# Altium schematic sheet SFPGA.SchDoc: System FPGA
size 420 x 297 mm; CheckedBy: T.Janicki; CompanyName: Creotech Instruments SA; DrawnBy: G.Kasprowicz; Organization: CERN; Address1: European Organization for Nuclear Research; Address2: CH-1211 Geneve 23 - Switzerland; DocumentNumber: 10; Revision: -; SheetNumber: 15; SheetTotal: 21; EDA_Number: EDA-xxxx; Projet: Simple VME FMC Carrier; CreateDate: 20/11/2012; CheckedDate: 30/04/2012; DivGrp: BE-CO; Designer: G.Kasprowicz; DocumentName: SFPGA.SchDoc; ModifiedDate: -; Rule: PcbType=ProtelPcb
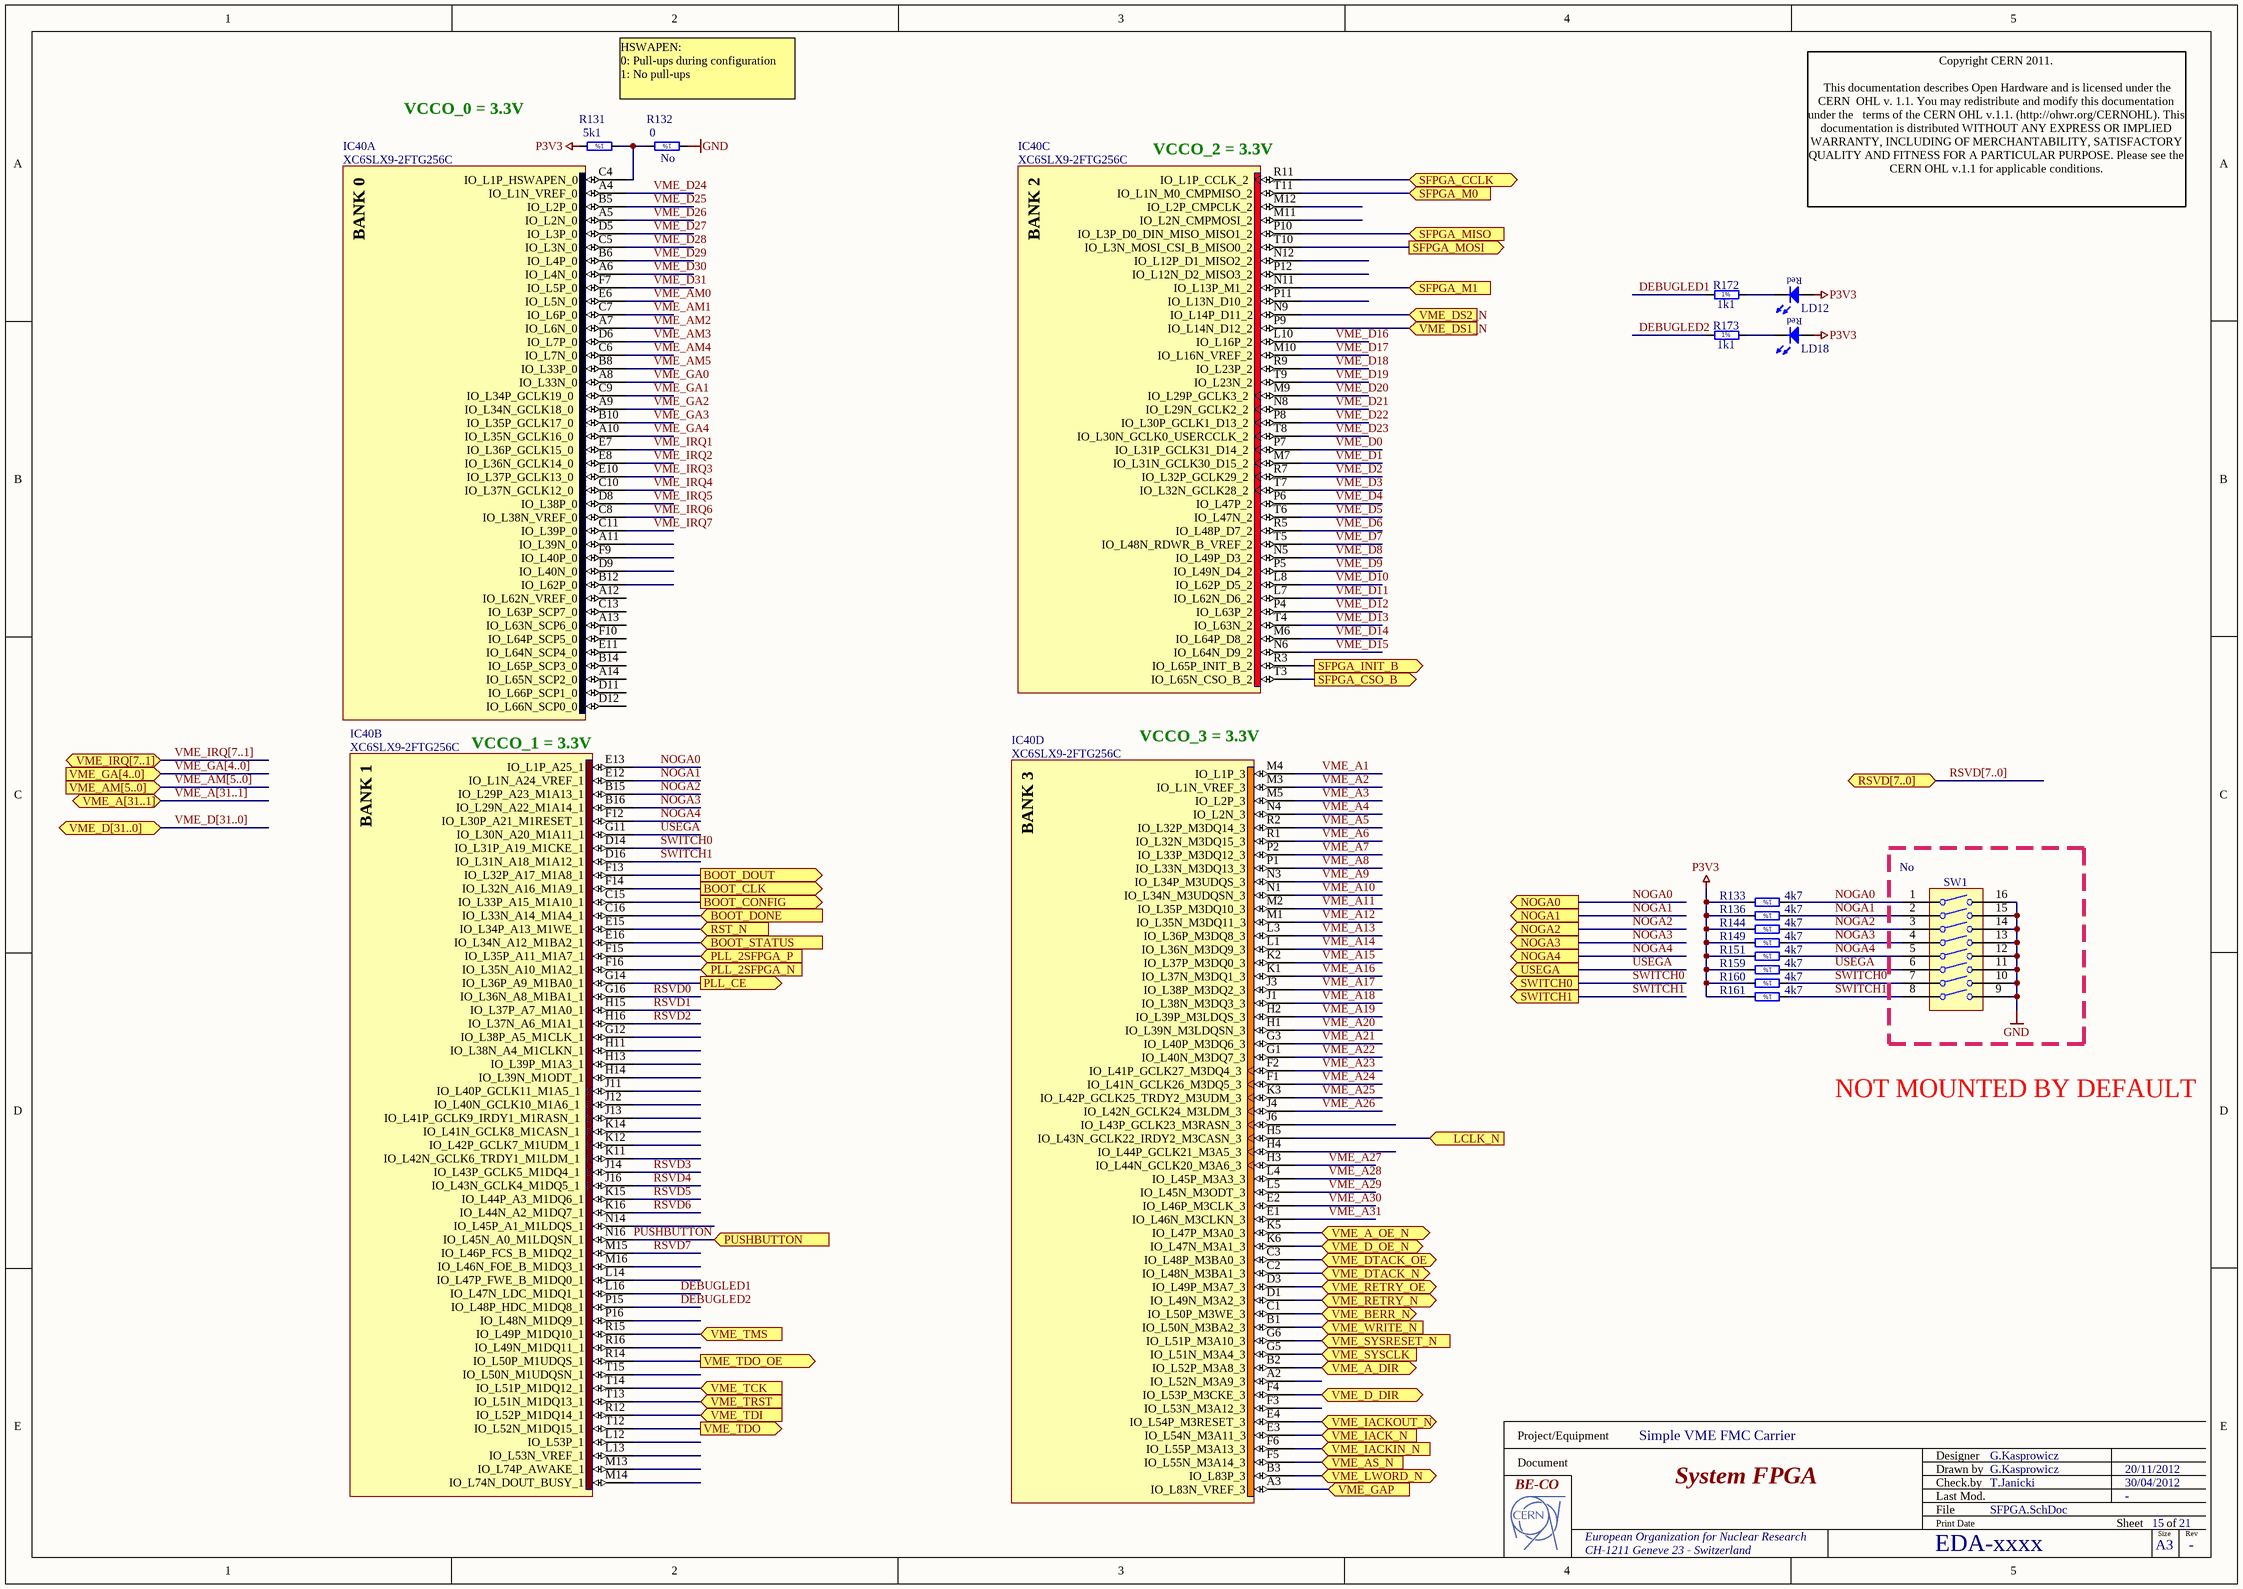
[diagram p0: SFPGA.SchDoc]

## Parts
IC40  XC6SLX9-2FTG256C  [BGA256C100P16X16_1700X1700X155]  (parts A,B,C,D of 7)
LD12  Red  [LEDC1608X80N_RED]  (value not drawn)
LD18  Red  [LEDC1608X80N_RED]  (value not drawn)
R131  5k1  [RESC1608X55N]
R132  0  Mounted: No  [RESC1608X55N]
R133  4k7  [RESC1608X55N]
R136  4k7  [RESC1608X55N]
R144  4k7  [RESC1608X55N]
R149  4k7  [RESC1608X55N]
R151  4k7  [RESC1608X55N]
R159  4k7  [RESC1608X55N]
R160  4k7  [RESC1608X55N]
R161  4k7  [RESC1608X55N]
R172  1k1  [RESC1608X55N]
R173  1k1  [RESC1608X55N]
SW1  Mounted: No  [SW_TYCO_1-1571983-0]  (hidden comment: Switch)

## Ports
BOOT_CLK (out), BOOT_CONFIG (out), BOOT_DONE (in), BOOT_DOUT (out), BOOT_STATUS (in), LCLK_N (in), NOGA0 (out), NOGA1 (out), NOGA2 (out), NOGA3 (out), NOGA4 (out), PLL_2SFPGA_N (in), PLL_2SFPGA_P (in), PLL_CE (out), PUSHBUTTON (in), RST_N (in), RSVD[7..0] (bidir), SFPGA_CCLK (bidir), SFPGA_CSO_B (out), SFPGA_INIT_B (out), SFPGA_M0 (in), SFPGA_M1 (in), SFPGA_MISO (in), SFPGA_MOSI (out), SWITCH0 (out), SWITCH1 (out), USEGA (out), VME_A[31..1] (bidir), VME_A_DIR (bidir), VME_A_OE_N (bidir), VME_AM[5..0] (in), VME_AS_N (in), VME_BERR_N (bidir), VME_D[31..0] (bidir), VME_D_DIR (bidir), VME_D_OE_N (bidir), VME_DS1_N (in), VME_DS2_N (in), VME_DTACK_N (bidir), VME_DTACK_OE (bidir), VME_GA[4..0] (in), VME_GAP (in), VME_IACK_N (in), VME_IACKIN_N (in), VME_IACKOUT_N (bidir), VME_IRQ[7..1] (bidir), VME_LWORD_N (bidir), VME_RETRY_N (bidir), VME_RETRY_OE (bidir), VME_SYSCLK (in), VME_SYSRESET_N (in), VME_TCK (in), VME_TDI (in), VME_TDO (out), VME_TDO_OE (out), VME_TMS (in), VME_TRST (in), VME_WRITE_N (in)

## Nets
GND: R132.1 SW1.9 SW1.10 SW1.11 SW1.12 SW1.13 SW1.14 SW1.15 SW1.16
P3V3: LD12.2(A) LD18.2(A) R131.2 R133.2 R136.2 R144.2 R149.2 R151.2 R159.2 R160.2 R161.2
BOOT_CLK: IC40.F14(IO_L32N_A16_M1A9_1) ; port BOOT_CLK
BOOT_CONFIG: IC40.C15(IO_L33P_A15_M1A10_1) ; port BOOT_CONFIG
BOOT_DONE: IC40.C16(IO_L33N_A14_M1A4_1) ; port BOOT_DONE
BOOT_DOUT: IC40.F13(IO_L32P_A17_M1A8_1) ; port BOOT_DOUT
BOOT_STATUS: IC40.E16(IO_L34N_A12_M1BA2_1) ; port BOOT_STATUS
DEBUGLED1: IC40.L16(IO_L47N_LDC_M1DQ1_1) R172.1
DEBUGLED2: IC40.P15(IO_L48P_HDC_M1DQ8_1) R173.1
LCLK_N: IC40.H5(IO_L43N_GCLK22_IRDY2_M3CASN_3) ; port LCLK_N
NOGA0: IC40.E13(IO_L1P_A25_1) R133.1 SW1.1 ; port NOGA0
NOGA1: IC40.E12(IO_L1N_A24_VREF_1) R136.1 SW1.2 ; port NOGA1
NOGA2: IC40.B15(IO_L29P_A23_M1A13_1) R144.1 SW1.3 ; port NOGA2
NOGA3: IC40.B16(IO_L29N_A22_M1A14_1) R149.1 SW1.4 ; port NOGA3
NOGA4: IC40.F12(IO_L30P_A21_M1RESET_1) R151.1 SW1.5 ; port NOGA4
PLL_2SFPGA_N: IC40.F16(IO_L35N_A10_M1A2_1) ; port PLL_2SFPGA_N
PLL_2SFPGA_P: IC40.F15(IO_L35P_A11_M1A7_1) ; port PLL_2SFPGA_P
PLL_CE: IC40.G14(IO_L36P_A9_M1BA0_1) ; port PLL_CE
PUSHBUTTON: IC40.N16(IO_L45N_A0_M1LDQSN_1) ; port PUSHBUTTON
RST_N: IC40.E15(IO_L34P_A13_M1WE_1) ; port RST_N
RSVD0: IC40.G16(IO_L36N_A8_M1BA1_1)
RSVD1: IC40.H15(IO_L37P_A7_M1A0_1)
RSVD2: IC40.H16(IO_L37N_A6_M1A1_1)
RSVD3: IC40.J14(IO_L43P_GCLK5_M1DQ4_1)
RSVD4: IC40.J16(IO_L43N_GCLK4_M1DQ5_1)
RSVD5: IC40.K15(IO_L44P_A3_M1DQ6_1)
RSVD6: IC40.K16(IO_L44N_A2_M1DQ7_1)
RSVD7: IC40.M15(IO_L46P_FCS_B_M1DQ2_1)
SFPGA_CCLK: IC40.R11(IO_L1P_CCLK_2) ; port SFPGA_CCLK
SFPGA_CSO_B: IC40.T3(IO_L65N_CSO_B_2) ; port SFPGA_CSO_B
SFPGA_INIT_B: IC40.R3(IO_L65P_INIT_B_2) ; port SFPGA_INIT_B
SFPGA_M0: IC40.T11(IO_L1N_M0_CMPMISO_2) ; port SFPGA_M0
SFPGA_M1: IC40.N11(IO_L13P_M1_2) ; port SFPGA_M1
SFPGA_MISO: IC40.P10(IO_L3P_D0_DIN_MISO_MISO1_2) ; port SFPGA_MISO
SFPGA_MOSI: IC40.T10(IO_L3N_MOSI_CSI_B_MISO0_2) ; port SFPGA_MOSI
SWITCH0: IC40.D14(IO_L31P_A19_M1CKE_1) R160.1 SW1.7 ; port SWITCH0
SWITCH1: IC40.D16(IO_L31N_A18_M1A12_1) R161.1 SW1.8 ; port SWITCH1
USEGA: IC40.G11(IO_L30N_A20_M1A11_1) R159.1 SW1.6 ; port USEGA
VME_A1: IC40.M4(IO_L1P_3)
VME_A2: IC40.M3(IO_L1N_VREF_3)
VME_A3: IC40.M5(IO_L2P_3)
VME_A4: IC40.N4(IO_L2N_3)
VME_A5: IC40.R2(IO_L32P_M3DQ14_3)
VME_A6: IC40.R1(IO_L32N_M3DQ15_3)
VME_A7: IC40.P2(IO_L33P_M3DQ12_3)
VME_A8: IC40.P1(IO_L33N_M3DQ13_3)
VME_A9: IC40.N3(IO_L34P_M3UDQS_3)
VME_A10: IC40.N1(IO_L34N_M3UDQSN_3)
VME_A11: IC40.M2(IO_L35P_M3DQ10_3)
VME_A12: IC40.M1(IO_L35N_M3DQ11_3)
VME_A13: IC40.L3(IO_L36P_M3DQ8_3)
VME_A14: IC40.L1(IO_L36N_M3DQ9_3)
VME_A15: IC40.K2(IO_L37P_M3DQ0_3)
VME_A16: IC40.K1(IO_L37N_M3DQ1_3)
VME_A17: IC40.J3(IO_L38P_M3DQ2_3)
VME_A18: IC40.J1(IO_L38N_M3DQ3_3)
VME_A19: IC40.H2(IO_L39P_M3LDQS_3)
VME_A20: IC40.H1(IO_L39N_M3LDQSN_3)
VME_A21: IC40.G3(IO_L40P_M3DQ6_3)
VME_A22: IC40.G1(IO_L40N_M3DQ7_3)
VME_A23: IC40.F2(IO_L41P_GCLK27_M3DQ4_3)
VME_A24: IC40.F1(IO_L41N_GCLK26_M3DQ5_3)
VME_A25: IC40.K3(IO_L42P_GCLK25_TRDY2_M3UDM_3)
VME_A26: IC40.J4(IO_L42N_GCLK24_M3LDM_3)
VME_A27: IC40.H3(IO_L44N_GCLK20_M3A6_3)
VME_A28: IC40.L4(IO_L45P_M3A3_3)
VME_A29: IC40.L5(IO_L45N_M3ODT_3)
VME_A30: IC40.E2(IO_L46P_M3CLK_3)
VME_A31: IC40.E1(IO_L46N_M3CLKN_3)
VME_A_DIR: IC40.B2(IO_L52P_M3A8_3) ; port VME_A_DIR
VME_A_OE_N: IC40.K5(IO_L47P_M3A0_3) ; port VME_A_OE_N
VME_AM0: IC40.E6(IO_L5N_0)
VME_AM1: IC40.C7(IO_L6P_0)
VME_AM2: IC40.A7(IO_L6N_0)
VME_AM3: IC40.D6(IO_L7P_0)
VME_AM4: IC40.C6(IO_L7N_0)
VME_AM5: IC40.B8(IO_L33P_0)
VME_AS_N: IC40.F5(IO_L55N_M3A14_3) ; port VME_AS_N
VME_BERR_N: IC40.C1(IO_L50P_M3WE_3) ; port VME_BERR_N
VME_D0: IC40.P7(IO_L31P_GCLK31_D14_2)
VME_D1: IC40.M7(IO_L31N_GCLK30_D15_2)
VME_D2: IC40.R7(IO_L32P_GCLK29_2)
VME_D3: IC40.T7(IO_L32N_GCLK28_2)
VME_D4: IC40.P6(IO_L47P_2)
VME_D5: IC40.T6(IO_L47N_2)
VME_D6: IC40.R5(IO_L48P_D7_2)
VME_D7: IC40.T5(IO_L48N_RDWR_B_VREF_2)
VME_D8: IC40.N5(IO_L49P_D3_2)
VME_D9: IC40.P5(IO_L49N_D4_2)
VME_D10: IC40.L8(IO_L62P_D5_2)
VME_D11: IC40.L7(IO_L62N_D6_2)
VME_D12: IC40.P4(IO_L63P_2)
VME_D13: IC40.T4(IO_L63N_2)
VME_D14: IC40.M6(IO_L64P_D8_2)
VME_D15: IC40.N6(IO_L64N_D9_2)
VME_D16: IC40.L10(IO_L16P_2)
VME_D17: IC40.M10(IO_L16N_VREF_2)
VME_D18: IC40.R9(IO_L23P_2)
VME_D19: IC40.T9(IO_L23N_2)
VME_D20: IC40.M9(IO_L29P_GCLK3_2)
VME_D21: IC40.N8(IO_L29N_GCLK2_2)
VME_D22: IC40.P8(IO_L30P_GCLK1_D13_2)
VME_D23: IC40.T8(IO_L30N_GCLK0_USERCCLK_2)
VME_D24: IC40.A4(IO_L1N_VREF_0)
VME_D25: IC40.B5(IO_L2P_0)
VME_D26: IC40.A5(IO_L2N_0)
VME_D27: IC40.D5(IO_L3P_0)
VME_D28: IC40.C5(IO_L3N_0)
VME_D29: IC40.B6(IO_L4P_0)
VME_D30: IC40.A6(IO_L4N_0)
VME_D31: IC40.F7(IO_L5P_0)
VME_D_DIR: IC40.F4(IO_L53P_M3CKE_3) ; port VME_D_DIR
VME_D_OE_N: IC40.K6(IO_L47N_M3A1_3) ; port VME_D_OE_N
VME_DS1_N: IC40.P9(IO_L14N_D12_2) ; port VME_DS1_N
VME_DS2_N: IC40.N9(IO_L14P_D11_2) ; port VME_DS2_N
VME_DTACK_N: IC40.C2(IO_L48N_M3BA1_3) ; port VME_DTACK_N
VME_DTACK_OE: IC40.C3(IO_L48P_M3BA0_3) ; port VME_DTACK_OE
VME_GA0: IC40.A8(IO_L33N_0)
VME_GA1: IC40.C9(IO_L34P_GCLK19_0)
VME_GA2: IC40.A9(IO_L34N_GCLK18_0)
VME_GA3: IC40.B10(IO_L35P_GCLK17_0)
VME_GA4: IC40.A10(IO_L35N_GCLK16_0)
VME_GAP: IC40.A3(IO_L83N_VREF_3) ; port VME_GAP
VME_IACK_N: IC40.E3(IO_L54N_M3A11_3) ; port VME_IACK_N
VME_IACKIN_N: IC40.F6(IO_L55P_M3A13_3) ; port VME_IACKIN_N
VME_IACKOUT_N: IC40.E4(IO_L54P_M3RESET_3) ; port VME_IACKOUT_N
VME_IRQ1: IC40.E7(IO_L36P_GCLK15_0)
VME_IRQ2: IC40.E8(IO_L36N_GCLK14_0)
VME_IRQ3: IC40.E10(IO_L37P_GCLK13_0)
VME_IRQ4: IC40.C10(IO_L37N_GCLK12_0)
VME_IRQ5: IC40.D8(IO_L38P_0)
VME_IRQ6: IC40.C8(IO_L38N_VREF_0)
VME_IRQ7: IC40.C11(IO_L39P_0)
VME_LWORD_N: IC40.B3(IO_L83P_3) ; port VME_LWORD_N
VME_RETRY_N: IC40.D1(IO_L49N_M3A2_3) ; port VME_RETRY_N
VME_RETRY_OE: IC40.D3(IO_L49P_M3A7_3) ; port VME_RETRY_OE
VME_SYSCLK: IC40.G5(IO_L51N_M3A4_3) ; port VME_SYSCLK
VME_SYSRESET_N: IC40.G6(IO_L51P_M3A10_3) ; port VME_SYSRESET_N
VME_TCK: IC40.T14(IO_L51P_M1DQ12_1) ; port VME_TCK
VME_TDI: IC40.R12(IO_L52P_M1DQ14_1) ; port VME_TDI
VME_TDO: IC40.T12(IO_L52N_M1DQ15_1) ; port VME_TDO
VME_TDO_OE: IC40.R14(IO_L50P_M1UDQS_1) ; port VME_TDO_OE
VME_TMS: IC40.R15(IO_L49P_M1DQ10_1) ; port VME_TMS
VME_TRST: IC40.T13(IO_L51N_M1DQ13_1) ; port VME_TRST
VME_WRITE_N: IC40.B1(IO_L50N_M3BA2_3) ; port VME_WRITE_N
NetIC40_C4: IC40.C4(IO_L1P_HSWAPEN_0) R131.1 R132.2
NetLD12_1: LD12.1(C) R172.2
NetLD18_1: LD18.1(C) R173.2

Not connected (* = marked no-connect by the designer): IC40 A2(IO_L52N_M3A9_3) A11(IO_L39N_0) A12(IO_L62N_VREF_0) A13(IO_L63N_SCP6_0) A14(IO_L65N_SCP2_0) B12(IO_L62P_0) B14(IO_L65P_SCP3_0) C13(IO_L63P_SCP7_0) D9(IO_L40N_0) D11(IO_L66P_SCP1_0) D12(IO_L66N_SCP0_0) E11(IO_L64N_SCP4_0) F3(IO_L53N_M3A12_3) F9(IO_L40P_0) F10(IO_L64P_SCP5_0) G12(IO_L38P_A5_M1CLK_1) H4(IO_L44P_GCLK21_M3A5_3) H11(IO_L38N_A4_M1CLKN_1) H13(IO_L39P_M1A3_1) H14(IO_L39N_M1ODT_1) J6(IO_L43P_GCLK23_M3RASN_3) J11(IO_L40P_GCLK11_M1A5_1) J12(IO_L40N_GCLK10_M1A6_1) J13(IO_L41P_GCLK9_IRDY1_M1RASN_1) K11(IO_L42N_GCLK6_TRDY1_M1LDM_1) K12(IO_L42P_GCLK7_M1UDM_1) K14(IO_L41N_GCLK8_M1CASN_1) L12(IO_L53P_1) L13(IO_L53N_VREF_1) L14(IO_L47P_FWE_B_M1DQ0_1) M11(IO_L2N_CMPMOSI_2) M12(IO_L2P_CMPCLK_2) M13(IO_L74P_AWAKE_1) M14(IO_L74N_DOUT_BUSY_1) M16(IO_L46N_FOE_B_M1DQ3_1) N12(IO_L12P_D1_MISO2_2) N14(IO_L45P_A1_M1LDQS_1) P11(IO_L13N_D10_2) P12(IO_L12N_D2_MISO3_2) P16(IO_L48N_M1DQ9_1) R16(IO_L49N_M1DQ11_1) T15(IO_L50N_M1UDQSN_1)

## Buses and harness runs
bus RSVD[7..0] = port RSVD[7..0]
bus VME_A[31..1] = port VME_A[31..1]
bus VME_AM[5..0] = port VME_AM[5..0]
bus VME_D[31..0] = port VME_D[31..0]
bus VME_GA[4..0] = port VME_GA[4..0]
bus VME_IRQ[7..1] = port VME_IRQ[7..1]

## Notes on the sheet
- VCCO_0 = 3.3V
- HSWAPEN:
  0: Pull-ups during configuration
  1: No pull-ups
- (near IC40) VCCO_2 = 3.3V
- Copyright CERN 2011.
  This documentation describes Open Hardware and is licensed under the CERN  OHL v. 1.1. You may redistribute and modify this documentation under the   terms of the CERN OHL v.1.1. (http://ohwr.org/CERNOHL). This  documentation is distributed WITHOUT ANY EXPRESS OR IMPLIED  WARRANTY, INCLUDING OF MERCHANTABILITY, SATISFACTORY  QUALITY AND FITNESS FOR A PARTICULAR PURPOSE. Please see the  CERN OHL v.1.1 for applicable conditions.
- (near IC40) VCCO_1 = 3.3V
- (near IC40) VCCO_3 = 3.3V
- NOT MOUNTED BY DEFAULT
- Project/Equipment
- Document
- Designer
- Drawn by
- Check.by
- File
- Last Mod.
- Print Date
- Sheet
- Size
- A3
- of
- Rev
- (in symbol R0603_0R_JUMPER) 1%
- (in symbol R0603_1K1_1%_0.1W_100PPM) 1%
- (in symbol R0603_4K7_1%_0.1W_100PPM) 1%
- (in symbol R0603_5K1_1%_0.1W_100PPM) 1%
- (in symbol XC6SLX9-2FTG256C, part A) BANK 0
- (in symbol XC6SLX9-2FTG256C, part B) BANK 1
- (in symbol XC6SLX9-2FTG256C, part C) BANK 2
- (in symbol XC6SLX9-2FTG256C, part D) BANK 3

## Library data of the parts
IC40 = XC6SLX9-2FTG256C: Spartan-6 LX 1.2V FPGA, 186 User I/Os, 256-Ball Fine-Pitch Thin BGA (1.0mm Pitch), Speed Grade 2, Commercial Grade, Pb-Free; Manufacturer: XILINX; Table: Logic; Part Number: XC6SLX9-2FTG256C; Component Kind: Standard; Component Type: Standard; Device: XC6SLX9-2FTG256C; PackageDescription: BGA 1mm, Pitch, Square 256 Pin, 16 Columns x 16 Rows, Body 17mm X 17mm X 1.55mm H; Part Description: Spartan-6 LX 1.2V FPGA, 186 User I/Os, 256-Ball Fine-Pitch Thin BGA (1.0mm Pitch), Speed Grade 2, Commercial Grade, Pb-Free; Manufacturer Part Number: XC6SLX9-2FTG256C; Pin Count: 256; Case: BGA256; Mounted: Yes; Socket: No; SMD: Yes; ComponentHeight: 1.55mm; HelpURL: \\cern.ch\dfs\Applications\Altium\Datasheets\XC6SLX9-2FTG256C.pdf; ComponentLink1URL: \\cern.ch\dfs\Applications\Altium\Datasheets\XC6SLX9-2FTG256C_Package-Pinout.pdf; ComponentLink1Description: Package/Pinouts; Author: CERN DEM JLC; CreateDate: 2011-11-01; LatestRevisionDate: 2011-11-01
LD12 LD18 = LED_ROHM_SML-311UTT86K: LED Red 1C 2A; Part Description: Low current chip LED SML-311 Serie; Manufacturer: ROHM; Table: LEDs & Displays; Part Number: LED_ROHM_SML-311UTT86K; Component Kind: Standard; Component Type: Standard; Color: Red; PackageDescription: Chip RED LED, 2-Leads, Body 1.6x0.8mm, IPC Medium Density; Manufacturer Part Number: SML-311UTT86K; Pin Count: 2; Mounted: Yes; Socket: No; SMD: Yes; ComponentHeight: 0.8mm; HelpURL: \\cern.ch\dfs\Applications\Altium\Datasheets\LED_ROHM_SML-311UTT86K.pdf; Author: CERN DEM JLC; CreateDate: 3/16/2010; LatestRevisionDate: 3/17/2010
R131 = R0603_5K1_1%_0.1W_100PPM: Resistor - 1%; Part Description: General Purpose Thick Film Chip Resistor; Manufacturer: GENERIC; Manufacturer1 Part Number: NRC06F5101TRF; Power: 0.1W; TC: ±100ppm/°C; Table: Resistors SMD; Part Number: R0603_5K1_1%_0.1W_100PPM; Component Kind: Standard; Component Type: Standard; Pin Count: 2; Value: 5k1; Status: Preferred; Tolerance: ±1%; Manufacturer Part Number: R0603_5K1_1%_0.1W_100PPM; Case: 0603; Mounted: Yes; Socket: No; SMD: Yes; Manufacturer1 Example: NIC COMPONENT; Manufacturer1 ComponentHeight: 0.55mm; HelpURL: \\cern.ch\dfs\Applications\Altium\Datasheets\R0603_NIC_NRC.pdf; Author: CERN DEM JLC; CreateDate: 03/12/2007; LatestRevisionDate: 13/03/2008
R132 = R0603_0R_JUMPER: Resistor - 1%; Part Description: 1A (0.05R Max DC Resistance) Zero Ohm Jumper; Manufacturer: GENERIC; Manufacturer1 Part Number: NRC06Z0; Table: Resistors SMD; Part Number: R0603_0R_JUMPER; Component Kind: Standard; Component Type: Standard; Pin Count: 2; Value: 0; Status: Preferred; Manufacturer Part Number: R0603_0R_JUMPER; Case: 0603; Socket: No; SMD: Yes; Manufacturer1 Example: NIC COMPONENT; Manufacturer1 ComponentHeight: 0.55mm; HelpURL: \\cern.ch\dfs\Applications\Altium\Datasheets\R0603_NIC_NRC.pdf; Author: CERN DEM JLC; CreateDate: 12/3/2007; LatestRevisionDate: 3/13/2008
R133 R136 R144 R149 R151 R159-R161 = R0603_4K7_1%_0.1W_100PPM: Resistor - 1%; Part Description: General Purpose Thick Film Chip Resistor; Manufacturer: GENERIC; Manufacturer1 Part Number: NRC06F4701TRF; Power: 0.1W; TC: ±100ppm/°C; Table: Resistors SMD; Part Number: R0603_4K7_1%_0.1W_100PPM; Component Kind: Standard; Component Type: Standard; Pin Count: 2; Value: 4k7; Status: Preferred; Tolerance: ±1%; Manufacturer Part Number: R0603_4K7_1%_0.1W_100PPM; Case: 0603; Mounted: Yes; Socket: No; SMD: Yes; Manufacturer1 Example: NIC COMPONENT; Manufacturer1 ComponentHeight: 0.55mm; HelpURL: \\cern.ch\dfs\Applications\Altium\Datasheets\R0603_NIC_NRC.pdf; Author: CERN DEM JLC; CreateDate: 03/12/2007; LatestRevisionDate: 13/03/2008
R172 R173 = R0603_1K1_1%_0.1W_100PPM: Resistor - 1%; Part Description: General Purpose Thick Film Chip Resistor; Manufacturer: GENERIC; Manufacturer1 Part Number: NRC06F1101TRF; Power: 0.1W; TC: ±100ppm/°C; Table: Resistors SMD; Part Number: R0603_1K1_1%_0.1W_100PPM; Component Kind: Standard; Component Type: Standard; Pin Count: 2; Value: 1k1; Status: Preferred; Tolerance: ±1%; Manufacturer Part Number: R0603_1K1_1%_0.1W_100PPM; Case: 0603; Mounted: Yes; Socket: No; SMD: Yes; Manufacturer1 Example: NIC COMPONENT; Manufacturer1 ComponentHeight: 0.55mm; HelpURL: \\cern.ch\dfs\Applications\Altium\Datasheets\R0603_NIC_NRC.pdf; Author: CERN DEM JLC; CreateDate: 2007-12-03; LatestRevisionDate: 2008-03-13
SW1 = SW_TYCO_1-1571983-0: 8 Ways SPST DIP Switch; Part Description: 8 Way SPST SMD DIP Switch, Latched, Contact Rating 0.025A 24VDC; Manufacturer: TYCO; Manufacturer Part Number: 1-1571983-0 or GDH08S04; Table: Switches; Part Number: SW_TYCO_1-1571983-0; Component Kind: Standard; Component Type: Standard; Pin Count: 16; PackageDescription: Pitch 1.27mm,  Body 11.28x6.2mm, 8 Ways SPST Surface-Mount DIP Switch,TYCO GDH Serie; Family: Switch; Socket: No; SMD: Yes; Status: None; ComponentHeight: 2.31mm; HelpURL: \\cern.ch\dfs\Applications\Altium\Datasheets\SW_TYCO_1-1571983-0.pdf; Author: CERN DEM JLC; CreateDate: 08/01/2009; LatestRevisionDate: 08/01/2009